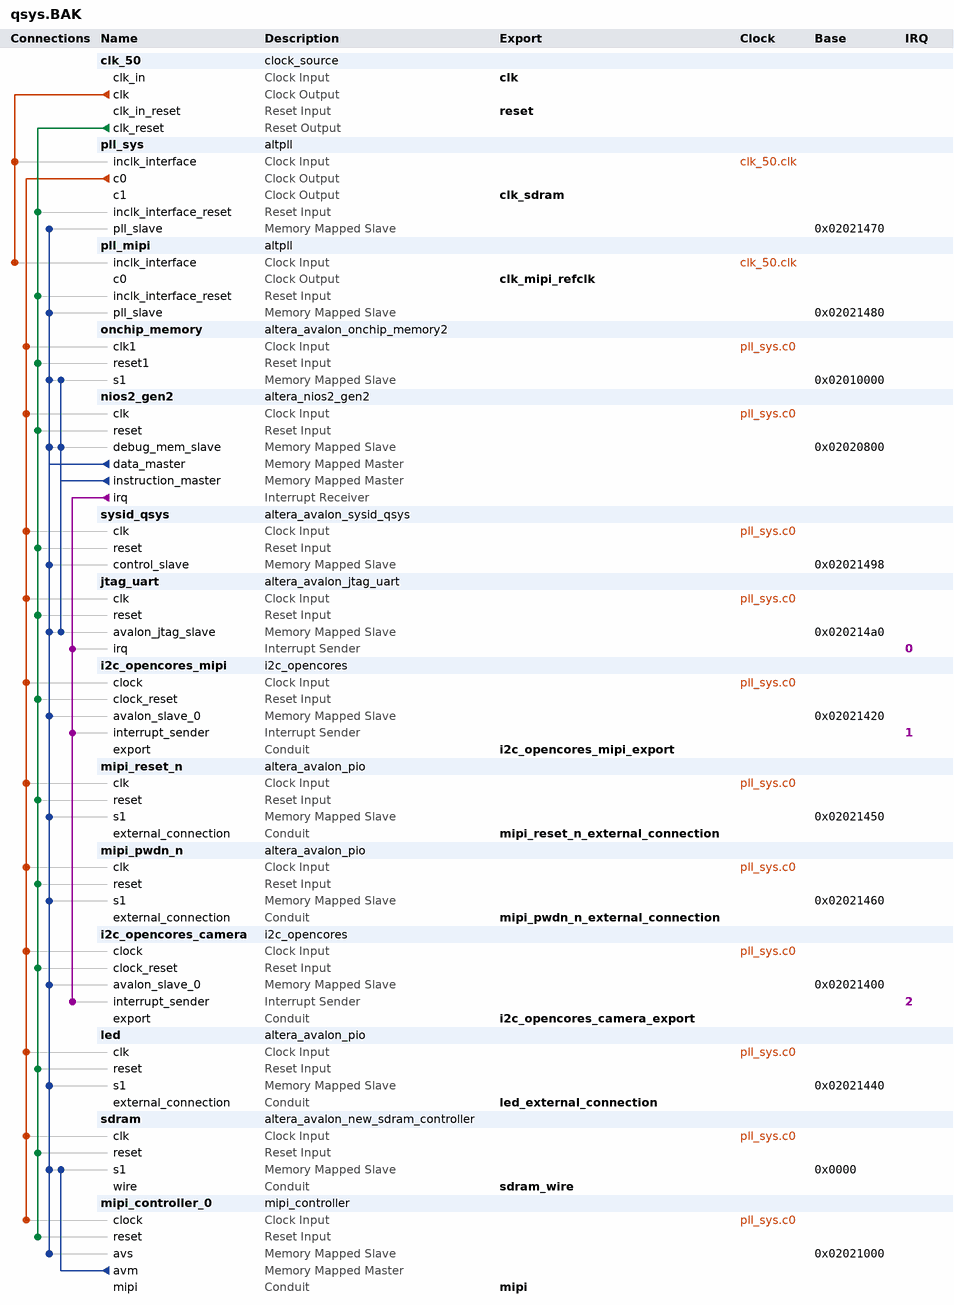
[diagram p0: system contents]
# Platform Designer (Qsys) system qsys.BAK, Cyclone IV E EP4CE22F17C6
# Parameters at their usual value, and those the tool derives, are not listed.
package require -exact qsys 17.0
create_system qsys.BAK
set_project_property DEVICE_FAMILY {Cyclone IV E}
set_project_property DEVICE EP4CE22F17C6

add_instance clk_50 clock_source 17.0
set_instance_parameter_value clk_50 clockFrequency 50000000

add_instance pll_sys altpll 17.0
set_instance_parameter_value pll_sys CLK0_DIVIDE_BY 1
set_instance_parameter_value pll_sys CLK0_MULTIPLY_BY 2
set_instance_parameter_value pll_sys CLK1_DIVIDE_BY 1
set_instance_parameter_value pll_sys CLK1_DUTY_CYCLE 50
set_instance_parameter_value pll_sys CLK1_MULTIPLY_BY 2
set_instance_parameter_value pll_sys CLK1_PHASE_SHIFT -1667
set_instance_parameter_value pll_sys INCLK0_INPUT_FREQUENCY 20000
set_instance_parameter_value pll_sys PORT_ARESET PORT_UNUSED
set_instance_parameter_value pll_sys PORT_LOCKED PORT_UNUSED
set_instance_parameter_value pll_sys PORT_clk1 PORT_USED
set_instance_parameter_value pll_sys PORT_clk2 PORT_UNUSED
set_instance_parameter_value pll_sys PORT_clk3 PORT_UNUSED

add_instance pll_mipi altpll 17.0
set_instance_parameter_value pll_mipi CLK0_DIVIDE_BY 5
set_instance_parameter_value pll_mipi CLK0_MULTIPLY_BY 2
set_instance_parameter_value pll_mipi INCLK0_INPUT_FREQUENCY 20000
set_instance_parameter_value pll_mipi OPERATION_MODE NO_COMPENSATION
set_instance_parameter_value pll_mipi PORT_ARESET PORT_UNUSED
set_instance_parameter_value pll_mipi PORT_LOCKED PORT_UNUSED
set_instance_parameter_value pll_mipi PORT_clk1 PORT_UNUSED
set_instance_parameter_value pll_mipi PORT_clk2 PORT_UNUSED
set_instance_parameter_value pll_mipi PORT_clk3 PORT_UNUSED

add_instance onchip_memory altera_avalon_onchip_memory2 17.0
set_instance_parameter_value onchip_memory dataWidth 32
set_instance_parameter_value onchip_memory dualPort false
set_instance_parameter_value onchip_memory initMemContent true
set_instance_parameter_value onchip_memory initializationFileName onchip_mem.hex
set_instance_parameter_value onchip_memory memorySize 40960

add_instance nios2_gen2 altera_nios2_gen2 17.0
set_instance_parameter_value nios2_gen2 dcache_size 2048
set_instance_parameter_value nios2_gen2 exceptionSlave onchip_memory.s1
set_instance_parameter_value nios2_gen2 icache_size 4096
set_instance_parameter_value nios2_gen2 impl Tiny
set_instance_parameter_value nios2_gen2 resetSlave onchip_memory.s1

add_instance sysid_qsys altera_avalon_sysid_qsys 17.0
set_instance_parameter_value sysid_qsys id 403708297

add_instance jtag_uart altera_avalon_jtag_uart 17.0
set_instance_parameter_value jtag_uart readBufferDepth 1024
set_instance_parameter_value jtag_uart readIRQThreshold 64
set_instance_parameter_value jtag_uart simInteractiveOptions NO_INTERACTIVE_WINDOWS
set_instance_parameter_value jtag_uart writeBufferDepth 1024
set_instance_parameter_value jtag_uart writeIRQThreshold 64

add_instance i2c_opencores_mipi i2c_opencores 12.0

add_instance mipi_reset_n altera_avalon_pio 17.0
set_instance_parameter_value mipi_reset_n direction Output
set_instance_parameter_value mipi_reset_n width 1

add_instance mipi_pwdn_n altera_avalon_pio 17.0
set_instance_parameter_value mipi_pwdn_n direction Output
set_instance_parameter_value mipi_pwdn_n width 1

add_instance i2c_opencores_camera i2c_opencores 12.0

add_instance led altera_avalon_pio 17.0
set_instance_parameter_value led direction Output
set_instance_parameter_value led width 8

add_instance sdram altera_avalon_new_sdram_controller 17.0
set_instance_parameter_value sdram TAC 5.5
set_instance_parameter_value sdram TRCD 20.0
set_instance_parameter_value sdram TRP 20.0
set_instance_parameter_value sdram casLatency 3
set_instance_parameter_value sdram columnWidth 9
set_instance_parameter_value sdram dataWidth 16
set_instance_parameter_value sdram generateSimulationModel false
set_instance_parameter_value sdram model single_Micron_MT48LC4M32B2_7_chip
set_instance_parameter_value sdram numberOfBanks 4
set_instance_parameter_value sdram numberOfChipSelects 1
set_instance_parameter_value sdram powerUpDelay 100.0
set_instance_parameter_value sdram refreshPeriod 15.625
set_instance_parameter_value sdram rowWidth 13

add_instance mipi_controller_0 mipi_controller 2.3

# connections
add_connection clk_50.clk pll_mipi.inclk_interface clock
add_connection clk_50.clk pll_sys.inclk_interface clock
add_connection pll_sys.c0 i2c_opencores_camera.clock clock
add_connection pll_sys.c0 i2c_opencores_mipi.clock clock
add_connection pll_sys.c0 jtag_uart.clk clock
add_connection pll_sys.c0 led.clk clock
add_connection pll_sys.c0 mipi_controller_0.clock clock
add_connection pll_sys.c0 mipi_pwdn_n.clk clock
add_connection pll_sys.c0 mipi_reset_n.clk clock
add_connection pll_sys.c0 nios2_gen2.clk clock
add_connection pll_sys.c0 onchip_memory.clk1 clock
add_connection pll_sys.c0 sdram.clk clock
add_connection pll_sys.c0 sysid_qsys.clk clock
add_connection clk_50.clk_reset i2c_opencores_camera.clock_reset reset
add_connection clk_50.clk_reset i2c_opencores_mipi.clock_reset reset
add_connection clk_50.clk_reset jtag_uart.reset reset
add_connection clk_50.clk_reset led.reset reset
add_connection clk_50.clk_reset mipi_controller_0.reset reset
add_connection clk_50.clk_reset mipi_pwdn_n.reset reset
add_connection clk_50.clk_reset mipi_reset_n.reset reset
add_connection clk_50.clk_reset nios2_gen2.reset reset
add_connection clk_50.clk_reset onchip_memory.reset1 reset
add_connection clk_50.clk_reset pll_mipi.inclk_interface_reset reset
add_connection clk_50.clk_reset pll_sys.inclk_interface_reset reset
add_connection clk_50.clk_reset sdram.reset reset
add_connection clk_50.clk_reset sysid_qsys.reset reset
add_connection mipi_controller_0.avm sdram.s1 avalon
set_connection_parameter_value mipi_controller_0.avm/sdram.s1 baseAddress 0x0000
add_connection nios2_gen2.data_master i2c_opencores_camera.avalon_slave_0 avalon
set_connection_parameter_value nios2_gen2.data_master/i2c_opencores_camera.avalon_slave_0 baseAddress 0x02021400
add_connection nios2_gen2.data_master i2c_opencores_mipi.avalon_slave_0 avalon
set_connection_parameter_value nios2_gen2.data_master/i2c_opencores_mipi.avalon_slave_0 baseAddress 0x02021420
add_connection nios2_gen2.data_master jtag_uart.avalon_jtag_slave avalon
set_connection_parameter_value nios2_gen2.data_master/jtag_uart.avalon_jtag_slave baseAddress 0x020214a0
add_connection nios2_gen2.data_master led.s1 avalon
set_connection_parameter_value nios2_gen2.data_master/led.s1 baseAddress 0x02021440
add_connection nios2_gen2.data_master mipi_controller_0.avs avalon
set_connection_parameter_value nios2_gen2.data_master/mipi_controller_0.avs baseAddress 0x02021000
add_connection nios2_gen2.data_master mipi_pwdn_n.s1 avalon
set_connection_parameter_value nios2_gen2.data_master/mipi_pwdn_n.s1 baseAddress 0x02021460
add_connection nios2_gen2.data_master mipi_reset_n.s1 avalon
set_connection_parameter_value nios2_gen2.data_master/mipi_reset_n.s1 baseAddress 0x02021450
add_connection nios2_gen2.data_master nios2_gen2.debug_mem_slave avalon
set_connection_parameter_value nios2_gen2.data_master/nios2_gen2.debug_mem_slave baseAddress 0x02020800
add_connection nios2_gen2.data_master onchip_memory.s1 avalon
set_connection_parameter_value nios2_gen2.data_master/onchip_memory.s1 baseAddress 0x02010000
add_connection nios2_gen2.data_master pll_mipi.pll_slave avalon
set_connection_parameter_value nios2_gen2.data_master/pll_mipi.pll_slave baseAddress 0x02021480
add_connection nios2_gen2.data_master pll_sys.pll_slave avalon
set_connection_parameter_value nios2_gen2.data_master/pll_sys.pll_slave baseAddress 0x02021470
add_connection nios2_gen2.data_master sdram.s1 avalon
set_connection_parameter_value nios2_gen2.data_master/sdram.s1 baseAddress 0x0000
add_connection nios2_gen2.data_master sysid_qsys.control_slave avalon
set_connection_parameter_value nios2_gen2.data_master/sysid_qsys.control_slave baseAddress 0x02021498
add_connection nios2_gen2.instruction_master jtag_uart.avalon_jtag_slave avalon
set_connection_parameter_value nios2_gen2.instruction_master/jtag_uart.avalon_jtag_slave baseAddress 0x020214a0
add_connection nios2_gen2.instruction_master nios2_gen2.debug_mem_slave avalon
set_connection_parameter_value nios2_gen2.instruction_master/nios2_gen2.debug_mem_slave baseAddress 0x02020800
add_connection nios2_gen2.instruction_master onchip_memory.s1 avalon
set_connection_parameter_value nios2_gen2.instruction_master/onchip_memory.s1 baseAddress 0x02010000
add_connection nios2_gen2.irq i2c_opencores_camera.interrupt_sender interrupt
set_connection_parameter_value nios2_gen2.irq/i2c_opencores_camera.interrupt_sender irqNumber 2
add_connection nios2_gen2.irq i2c_opencores_mipi.interrupt_sender interrupt
set_connection_parameter_value nios2_gen2.irq/i2c_opencores_mipi.interrupt_sender irqNumber 1
add_connection nios2_gen2.irq jtag_uart.irq interrupt
set_connection_parameter_value nios2_gen2.irq/jtag_uart.irq irqNumber 0

# exported interfaces
add_interface clk clock sink
set_interface_property clk EXPORT_OF clk_50.clk_in
add_interface clk_mipi_refclk clock source
set_interface_property clk_mipi_refclk EXPORT_OF pll_mipi.c0
add_interface clk_sdram clock source
set_interface_property clk_sdram EXPORT_OF pll_sys.c1
add_interface i2c_opencores_camera_export conduit end
set_interface_property i2c_opencores_camera_export EXPORT_OF i2c_opencores_camera.export
add_interface i2c_opencores_mipi_export conduit end
set_interface_property i2c_opencores_mipi_export EXPORT_OF i2c_opencores_mipi.export
add_interface led_external_connection conduit end
set_interface_property led_external_connection EXPORT_OF led.external_connection
add_interface mipi conduit end
set_interface_property mipi EXPORT_OF mipi_controller_0.mipi
add_interface mipi_pwdn_n_external_connection conduit end
set_interface_property mipi_pwdn_n_external_connection EXPORT_OF mipi_pwdn_n.external_connection
add_interface mipi_reset_n_external_connection conduit end
set_interface_property mipi_reset_n_external_connection EXPORT_OF mipi_reset_n.external_connection
add_interface reset reset sink
set_interface_property reset EXPORT_OF clk_50.clk_in_reset
add_interface sdram_wire conduit end
set_interface_property sdram_wire EXPORT_OF sdram.wire

set_interconnect_requirement {$system} qsys_mm.clockCrossingAdapter FIFO
set_interconnect_requirement {$system} qsys_mm.enableEccProtection FALSE
set_interconnect_requirement {$system} qsys_mm.insertDefaultSlave FALSE
set_interconnect_requirement {$system} qsys_mm.maxAdditionalLatency 1

save_system qsys.BAK.qsys
